# EasyEDA Pro project ESP8266开发板.eprj

# Schematic 原理图
Create Date: 2023-08-28; Page Name: P1; Project Name: ESP8266开发板; Schematic Name: 原理图; Update Date: 2023-08-28
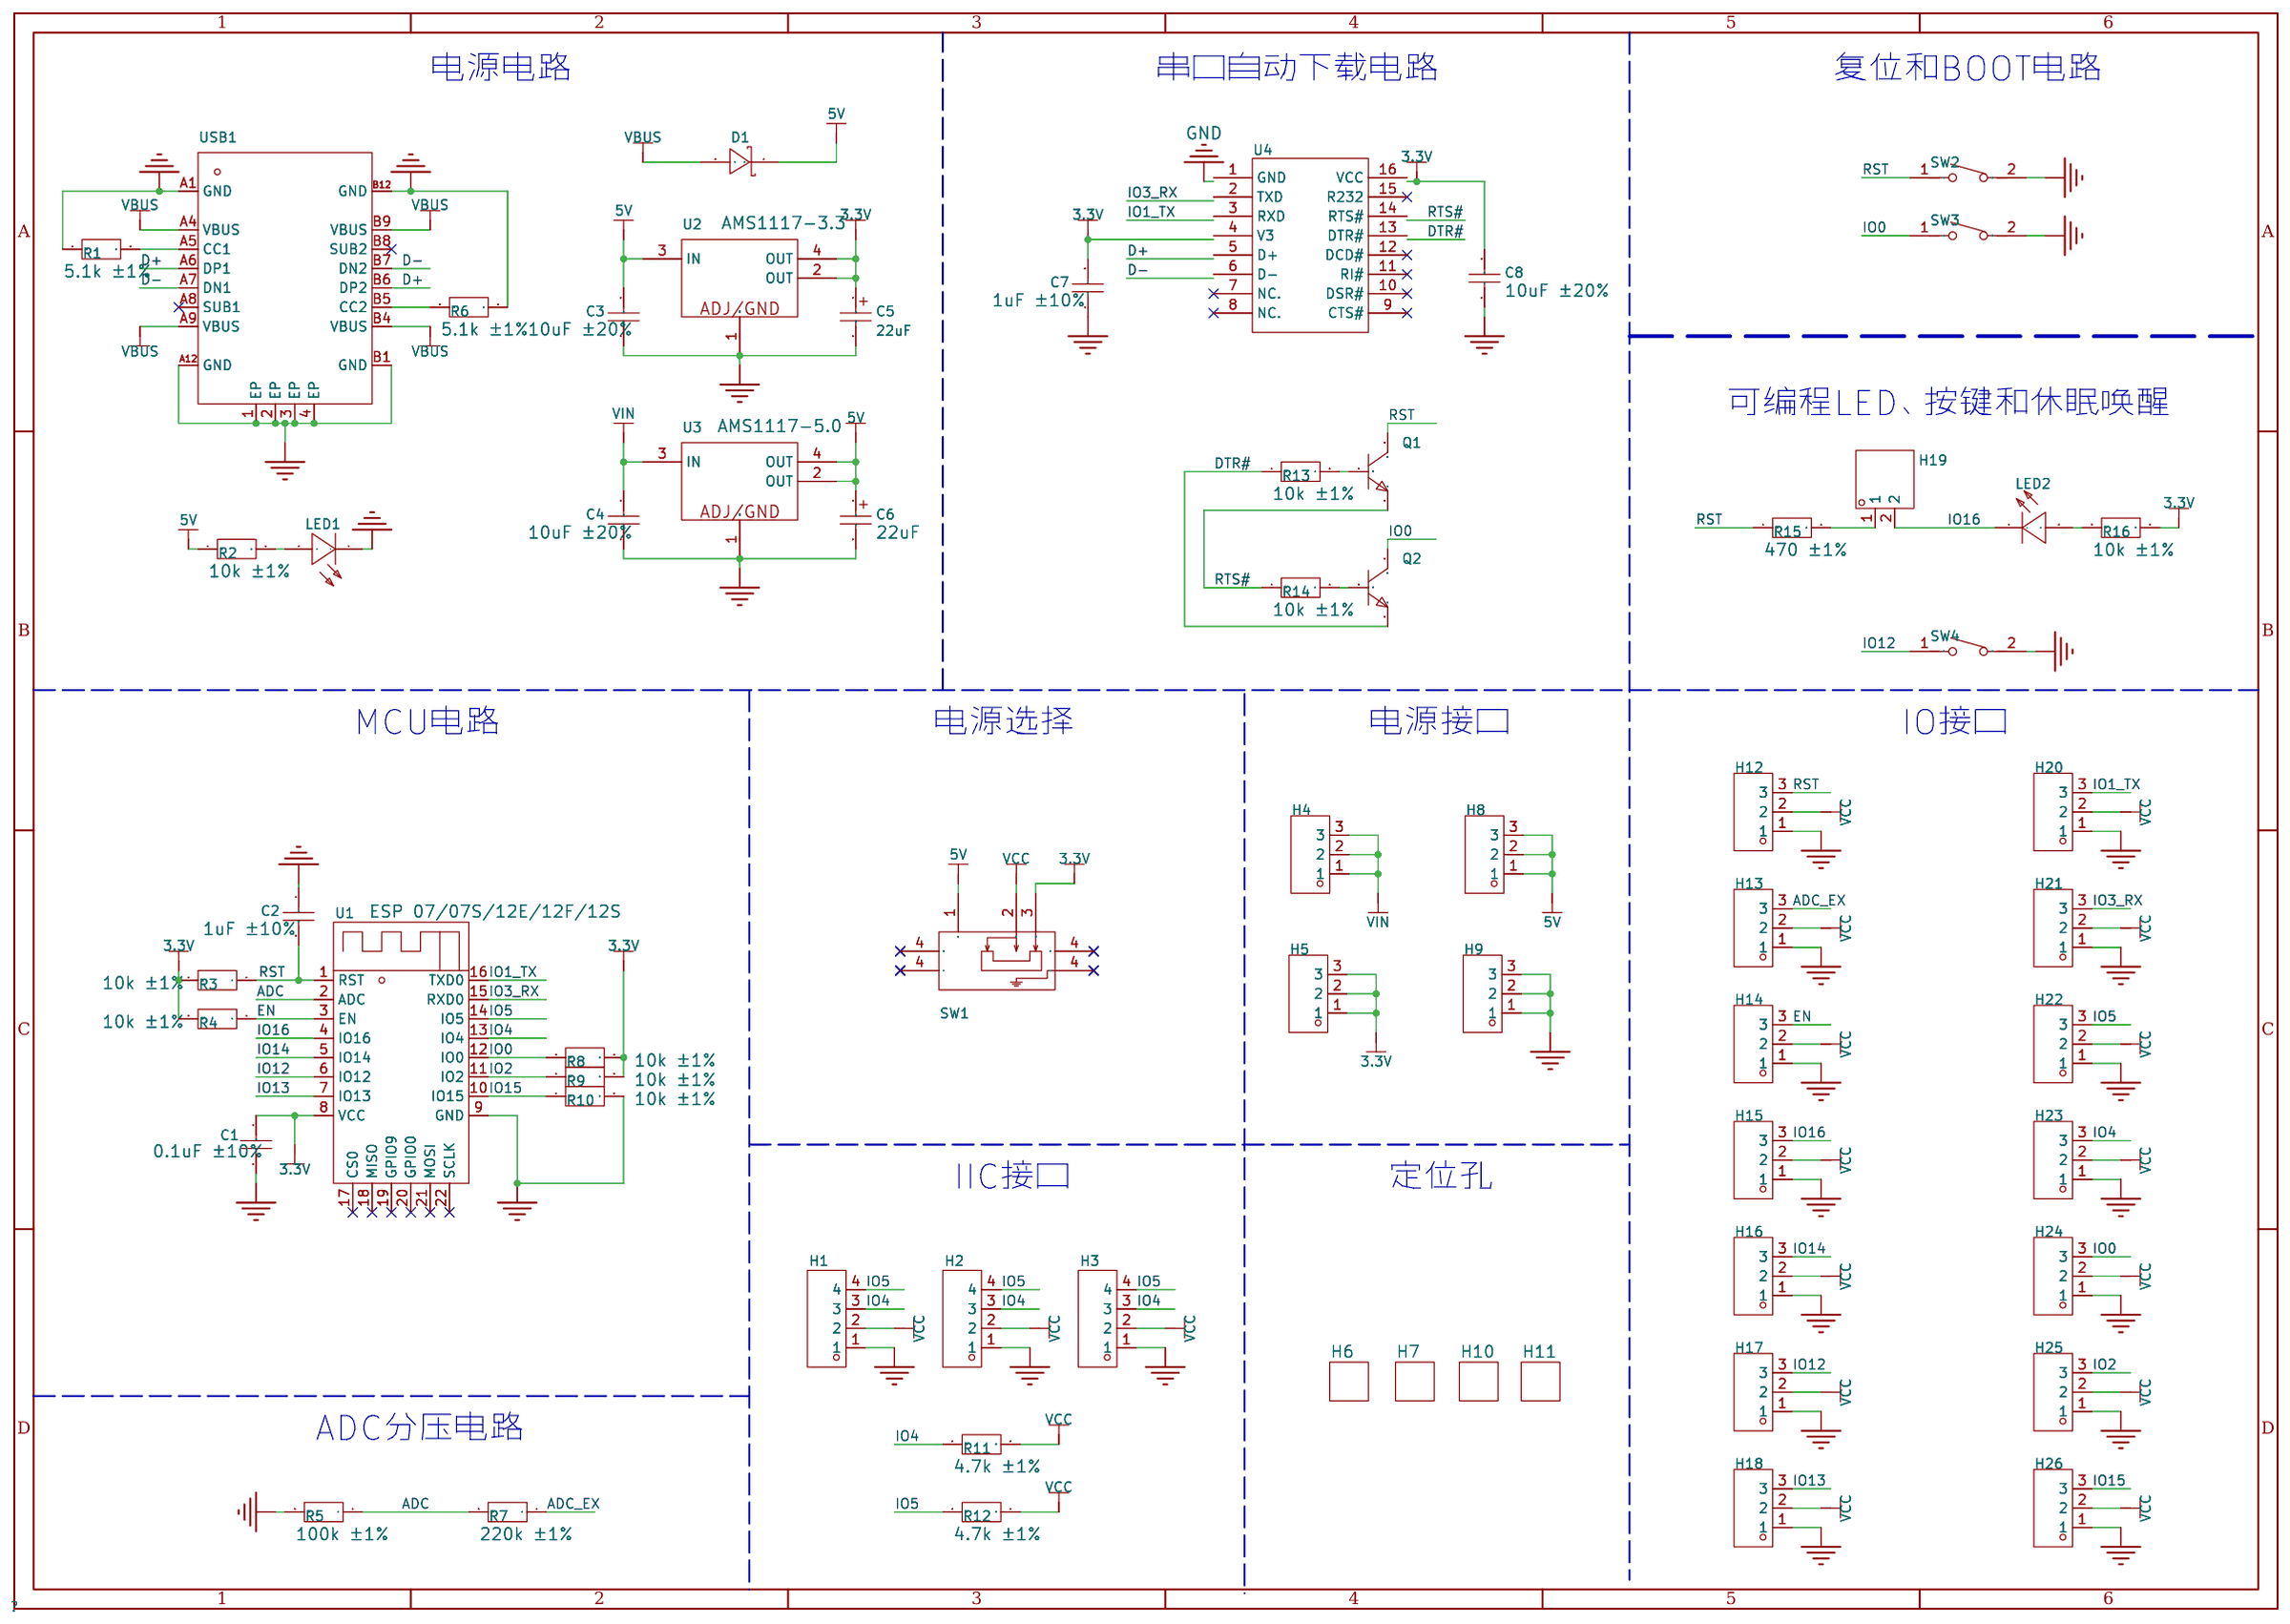
[diagram p0: schematic sheet]

## Parts
C1  0.1uF ±10%  [C0603]
C2  1uF ±10%  [C0603]
C3  10uF ±20%  [C0603]
C4  10uF ±20%  [C0603]
C5  22uF  [CAP-SMD_L3.5-W2.8-R-RD]
C6  22uF  [CAP-SMD_L3.5-W2.8-R-RD]
C7  1uF ±10%  [C0603]
C8  10uF ±20%  [C0603]
D1  SS24  [DO-214AC_L4.3-W2.7-LS5.3-RD]
H1  826629-4  [HDR-TH_4P-P2.54-V-M-1]
H2  826629-4  [HDR-TH_4P-P2.54-V-M-1]
H3  826629-4  [HDR-TH_4P-P2.54-V-M-1]
H4  2.54-1*3P针  [HDR-TH_3P-P2.54-V-M-1]
H5  2.54-1*3P针  [HDR-TH_3P-P2.54-V-M-1]
H6  Hole-3mm-JK 孔  [HOLE-3MM]
H7  Hole-3mm-JK 孔  [HOLE-3MM]
H8  2.54-1*3P针  [HDR-TH_3P-P2.54-V-M-1]
H9  2.54-1*3P针  [HDR-TH_3P-P2.54-V-M-1]
H10  Hole-3mm-JK 孔  [HOLE-3MM]
H11  Hole-3mm-JK 孔  [HOLE-3MM]
H12  2.54-1*3P针  [HDR-TH_3P-P2.54-V-M-1]
H13  2.54-1*3P针  [HDR-TH_3P-P2.54-V-M-1]
H14  2.54-1*3P针  [HDR-TH_3P-P2.54-V-M-1]
H15  2.54-1*3P针  [HDR-TH_3P-P2.54-V-M-1]
H16  2.54-1*3P针  [HDR-TH_3P-P2.54-V-M-1]
H17  2.54-1*3P针  [HDR-TH_3P-P2.54-V-M-1]
H18  2.54-1*3P针  [HDR-TH_3P-P2.54-V-M-1]
H19  -  [HDR-TH_2P-P2.54-V-M-1]
H20  2.54-1*3P针  [HDR-TH_3P-P2.54-V-M-1]
H21  2.54-1*3P针  [HDR-TH_3P-P2.54-V-M-1]
H22  2.54-1*3P针  [HDR-TH_3P-P2.54-V-M-1]
H23  2.54-1*3P针  [HDR-TH_3P-P2.54-V-M-1]
H24  2.54-1*3P针  [HDR-TH_3P-P2.54-V-M-1]
H25  2.54-1*3P针  [HDR-TH_3P-P2.54-V-M-1]
H26  2.54-1*3P针  [HDR-TH_3P-P2.54-V-M-1]
LED1  -  [LED0805-RD]
LED2  -  [LED0805-RD]
Q1  S8050  [SOT-23-3_L2.9-W1.3-P1.90-LS2.4-BR]
Q2  S8050  [SOT-23-3_L2.9-W1.3-P1.90-LS2.4-BR]
R1  5.1k ±1%  [R0603]
R2  10k ±1%  [R0603]
R3  10k ±1%  [R0603]
R4  10k ±1%  [R0603]
R5  100k ±1%  [R0603]
R6  5.1k ±1%  [R0603]
R7  220k ±1%  [R0603]
R8  10k ±1%  [R0603]
R9  10k ±1%  [R0603]
R10  10k ±1%  [R0603]
R11  4.7k ±1%  [R0603]
R12  4.7k ±1%  [R0603]
R13  10k ±1%  [R0603]
R14  10k ±1%  [R0603]
R15  470 ±1%  [R0603]
R16  10k ±1%  [R0603]
SW1  MSK12C02  [SW-TH_MSK12C02]
SW2  TS-KG88C-ACT25F  [KEY-SMD_L4.0-W2.9-LS4.8]
SW3  TS-KG88C-ACT25F  [KEY-SMD_L4.0-W2.9-LS4.8]
SW4  TS-KG88C-ACT25F  [KEY-SMD_L4.0-W2.9-LS4.8]
U1  ESP 07/07S/12E/12F/12S  [WIFIM-SMD_22P-L24.0-W16.0-P2.00]
U2  AMS1117-3.3  [SOT-223-3_L6.4-W3.5-P2.30-LS7.0-BR]
U3  AMS1117-5.0  [SOT-223-3_L6.4-W3.5-P2.30-LS7.0-BR]
U4  CH340C  [SOP-16_L10.0-W3.9-P1.27-LS6.0-BL]
USB1  KH-TYPE-C-16P  [USB-C-SMD_KH-TYPE-C-16P]

## Library data of the parts
C1 = C0603: 1uF ±10%; Pin Type: IN
C2 C7 C8 = C0603: Pin Type: IN
C3 C4 = C0603: 10uF ±10%; Pin Type: IN
C5 C6 = CA45-B-25V-22uF: LCSC Part Name: 22uF(106) ±10% 25V; Supplier Part: C128259; Manufacturer: CEC(振华新云); Manufacturer Part: CA45-B-25V-22uF-K; Supplier Footprint: CASE-B_3528; Datasheet: https://atta.szlcsc.com/upload/public/pdf/source/20170914/C128259_1505359753672967907.pdf; Supplier: LCSC; Operating Temperature: -55~+125; Equivalent Series Resistance(ESR): 6Ω 100kHz; Rated Voltage: 25V; Tolerance: ±10%
D1 = SS24: 直流反向耐压(Vr):40V;平均整流电流(Io):2A;正向压降(Vf):500mV@2A;; LCSC Part Name: 40V 2A 500mV@2A; Supplier Part: C84028; Manufacturer: 星海; Supplier Footprint: SMA(DO-214AC); JLCPCB Part Class: Extended Part; Datasheet: https://atta.szlcsc.com/upload/public/pdf/source/20170717/C84028_1500269981899820784.pdf; Supplier: LCSC; Reverse Voltage (Vr): 40V; Average Rectified Current (Io): 2A; Forward Voltage (Vf@If): 500mV@2A
H1-H3 = 826629-4: 间距:2.54mm;总PIN位数:4;排数:1;插针结构:1x4P;行距:-;安装类型:直插;圆针/方针:-;额定电流:-;额定电压:-;配合针长度:6.7mm;塑高:2.8mm;端接针长度:3.2mm;触头材质:-;工作温度范围:-;颜色:绿色;; LCSC Part Name: 2.54mm 1x4P 直插; Supplier Part: C590277; Manufacturer: TE Connectivity(美国泰科); Supplier Footprint: 直插,P=2.54mm; JLCPCB Part Class: Extended Part; Datasheet: https://atta.szlcsc.com/upload/public/pdf/source/20210923/FCC8CD9A04BA2624CF68C067B4A5B53A.pdf; Supplier: LCSC; Pitch: 2.54mm; Number of Pins: 4; Number of Rows: 1; Pin Structure: 1x4P; Mounting Type: 直插; Length of Mating Pin: 6.7mm; Insulation Height: 2.8mm; Length of End Connection Pin: 3.2mm; Color: 绿色
H4 H5 H8 H9 H12-H18 H20-H26 = 2.54-1*3P针: 间距:2.54mm;总PIN位数:3;排数:1;插针结构:1x3P;行距:-;安装类型:直插;圆针/方针:方针;额定电流:3A;额定电压:-;配合针长度:-;塑高:-;端接针长度:-;触头材质:-;触头镀层:-;工作温度范围:-40℃~+105℃;颜色:黑色;; LCSC Part Name: 2.54mm 1x3P 直插 方针; Supplier Part: C49257; Manufacturer: BOOMELE(博穆精密); Supplier Footprint: 插件,P=2.54mm; JLCPCB Part Class: Extended Part; Datasheet: https://atta.szlcsc.com/upload/public/pdf/source/20151109/1457707570948.pdf; Supplier: LCSC; Pitch: 2.54mm; Number of Pins: 3; Number of Rows: 1; Pin Structure: 1x3P; Mounting Type: 直插; Circluar Pins/Square Pins: 方针; Current Rating (Max): 3A; Operating Temperature Range: -40℃~+105℃; Color: 黑色
H6 H7 H10 H11 = Hole-3mm-JK 孔: Manufacturer Part: Hole-3mm
H19 = HDR-M_2.54_1x2P: Supplier Part: C124375; Supplier Footprint: 插件
LED1 LED2 = LED 0805: LED 0805;; Manufacturer: 国星光电; Supplier Footprint: 0805
Q1 Q2 = S8050: NPN 25V 500mA 120-400 SOT-23; Supplier Part: C2931719; Manufacturer: Doeshare(德芯); Supplier Footprint: SOT-23; JLCPCB Part Class: Extended Part; Datasheet: https://atta.szlcsc.com/upload/public/pdf/source/20220117/E6D3315E0D6ADDB25840BFFAC039C5C0.pdf; Supplier: LCSC
R1 R5-R7 R11 R12 R15 = CR0603FA4R30G: 10k ±1%; LCSC Part Name: 10k ±1%; Supplier Part: C3037517; Manufacturer: LIZ(丽智电子); Supplier Footprint: 0603; Datasheet: https://atta.szlcsc.com/upload/public/pdf/source/20180403/C189438_6D658388CC7843F35BBC9018D03F0B8E.pdf; Supplier: LCSC
R2-R4 R8-R10 R13 R14 R16 = CR0603FA4R30G: Supplier Part: C3037517; Manufacturer: LIZ(丽智电子); Supplier Footprint: 0603; Datasheet: https://atta.szlcsc.com/upload/public/pdf/source/20180403/C189438_6D658388CC7843F35BBC9018D03F0B8E.pdf; Supplier: LCSC
SW1 = MSK12C02: LCSC Part Name: 两档侧拨贴片 7脚 拨动 白柄 柄长1.5mm,带定位柱; Supplier Part: C431540; Manufacturer: SHOU HAN(首韩); Supplier Footprint: SMD; JLCPCB Part Class: 扩展库; Datasheet: https://atta.szlcsc.com/upload/public/pdf/source/20190925/C431540_89155AEF0758B9AD1B2D805F83FB12E3.pdf; Supplier: LCSC
SW2-SW4 = TS-KG88C-ACT25F: 触点电流:50mA;额定电压(DC):12V;绝缘电阻:100MΩ;电路结构:单刀单掷;安装方式:立贴;按钮形状:圆形按钮;按钮/盖帽颜色:黑色;作用力:250gf@±50gf;引脚样式:SMD接片;开关长度:4mm;开关宽度:2.9mm;开关高度:2.5mm;带支架:否;; LCSC Part Name: 3*4*2.5两脚贴片正按小龟轻触开关; Supplier Part: C2874431; Manufacturer: HANBO(汉博); Supplier Footprint: SMD; JLCPCB Part Class: Extended Part; Datasheet: https://atta.szlcsc.com/upload/public/pdf/source/20210827/A314F28E685D7845759E07CCF7D4F190.pdf; Supplier: LCSC; Contact Current: 50mA; Voltage Rating (DC): 12V; Insulation Resistance: 100MΩ; Circuit: 单刀单掷; Mounting Style: 立贴; Actuator Style: 圆形按钮; Actuator/Cap Color: 黑色; Operating Force: 250gf@±50gf; Pin Style: SMD接片; Switch Length: 4mm; Switch Width: 2.9mm; Switch Height: 2.5mm; Strike Gundam: 否
U1 = WT8266-S5 ESP-12F: WT8266-S5是ESP8266核载PCB天线wifi模组，32位型MCU超低功耗高性价比的嵌入式无线网络控制模块，主频支持80MHz和160MHz,支持RTOS,集成wi-Fi MAC/BB/RF/PA/LNA,外接弹簧天线，支持标准IEEE802.11b/g/n协议，完整的TCP/IP协议栈，可满足智能电网，楼宇自动化，安防，智能家居，远程医疗等物联网应用需求。; Supplier Part: C477829; Manufacturer: Wireless-tag(启明云端); JLCPCB Part Class: 扩展库; Datasheet: https://atta.szlcsc.com/upload/public/pdf/source/20200102/C477829_C0273E46BF0DD2E76CD6AB775D1C166F.pdf; Supplier: LCSC
U2 U3 = AMS1117-3.3: Supplier Part: C2992570; Manufacturer: 国芯佳品; Supplier Footprint: SOT-223; JLCPCB Part Class: Extended Part; Datasheet: https://atta.szlcsc.com/upload/public/pdf/source/20220729/0D21C21EC310E4778671BF6BAE438640.pdf; Supplier: LCSC
U4 = CH340C: 类型:Transceiver;协议类别:USB 2.0;驱动器/接收器数:-;数据速率:2Mbps;; Supplier Part: C84681; Manufacturer: WCH(南京沁恒); Supplier Footprint: SOP-16_150mil; JLCPCB Part Class: Extended Part; Datasheet: https://atta.szlcsc.com/upload/public/pdf/source/20200819/C84681_ADBED554CE321879DBD6B1D06488689C.pdf; Supplier: LCSC; Type: Transceiver; Protocol: USB 2.0; Data Rate: 2Mbps; Supply Voltage: 3.3V, 5V
USB1 = KH-TYPE-C-16P: 连接器类型:Type-C;标准:-;公母:母座;触点数量:16;端口数量:1;安装方式:卧贴;额定电流 - 电源:3A;工作温度范围:-40~+85;; LCSC Part Name: Type-C 母座 卧贴; Supplier Part: C709357; Manufacturer: kinghelm(金航标); Supplier Footprint: SMD; JLCPCB Part Class: Extended Part; Datasheet: https://atta.szlcsc.com/upload/public/pdf/source/20200911/C709357_AA8DCEB38BB20E3035A7ED7AE7667837.pdf; Supplier: LCSC; Connector Type: Type-C; Gender: 母座; Number of Contacts: 16; Number of Ports: 1; Mounting Style: 卧贴; Current Rating - Power (Max): 3A; Operating Temperature Range: -40~+85

## Nets
3.3V: C1.1 C5.1 C7.2 C8.1 H5.1 H5.2 H5.3 R3.2 R4.2 R8.2 R9.2 R16.2 SW1.3 U1.8(VCC) U2.2(OUT) U2.4(OUT)
5V: C3.2 C6.1 D1.1(K) H8.1 H8.2 H8.3 R2.1 SW1.1 U2.3(IN) U3.2(OUT) U3.4(OUT)
GND: C1.2 C2.1 C3.1 C4.1 C5.2 C6.2 C7.1 C8.2 H1.1 H2.1 H3.1 H9.1 H9.2 H9.3 H12.1 H13.1 H14.1 H15.1 H16.1 H17.1 H18.1 H20.1 H21.1 H22.1 H23.1 H24.1 H25.1 H26.1 LED1.1(-) R1.1 R5.2 R6.2 R10.2 SW2.2 SW3.2 SW4.2 U1.9(GND) U2.1(ADJ/GND) U3.1(ADJ/GND) USB1.1(EP) USB1.2(EP) USB1.3(EP) USB1.4(EP) USB1.A1(GND) USB1.A12(GND) USB1.B1(GND) USB1.B12(GND)
VBUS: D1.2(A) USB1.A4(VBUS) USB1.A9(VBUS) USB1.B4(VBUS) USB1.B9(VBUS)
VCC: H1.2 H2.2 H3.2 H12.2 H13.2 H14.2 H15.2 H16.2 H17.2 H18.2 H20.2 H21.2 H22.2 H23.2 H24.2 H25.2 H26.2 R11.1 R12.1 SW1.2
VIN: C4.2 H4.1 H4.2 H4.3 U3.3(IN)
ADC: R5.1 R7.2 U1.2(ADC)
ADC_EX: H13.3 R7.1
D+: USB1.A6(DP1) USB1.B6(DP2)
D-: USB1.A7(DN1) USB1.B7(DN2)
DTR#: Q2.2(E) R13.1
EN: H14.3 R4.1 U1.3(EN)
IO0: H24.3 Q2.3(C) R8.1 SW3.1 U1.12(IO0)
IO1_TX: H20.3 U1.16(TXD0)
IO2: H25.3 R9.1 U1.11(IO2)
IO3_RX: H21.3 U1.15(RXD0)
IO4: H1.3 H2.3 H3.3 H23.3 R11.2 U1.13(IO4)
IO5: H1.4 H2.4 H3.4 H22.3 R12.2 U1.14(IO5)
IO12: H17.3 SW4.1 U1.6(IO12)
IO13: H18.3 U1.7(IO13)
IO14: H16.3 U1.5(IO14)
IO15: H26.3 R10.1 U1.10(IO15)
IO16: H15.3 H19.2 LED2.1(-) U1.4(IO16)
RST: C2.2 H12.3 Q1.3(C) R3.1 R15.1 SW2.1 U1.1(RST)
RTS#: Q1.2(E) R14.1
$1N5501: Q1.1(B) R13.2
$1N5507: R1.2 USB1.A5(CC1)
$1N5511: R6.1 USB1.B5(CC2)
$1N5519: LED1.2(+) R2.2
$1N5528: Q2.1(B) R14.2
$1N19675: LED2.2(+) R16.1
$1N33225: H19.1 R15.2

Not connected (* = marked no-connect by the designer): SW1 4*; U1 17(CS0)* 18(MISO)* 19(GPIO9)* 20(GPIO0)* 21(MOSI)* 22(SCLK)*; U4 1(GND) 2(TXD) 3(RXD) 4(V3) 5(D+) 6(D-) 7(NC.)* 8(NC.)* 9(CTS#)* 10(DSR#)* 11(RI#)* 12(DCD#)* 13(DTR#) 14(RTS#) 15(R232)* 16(VCC); USB1 A8(SUB1)* B8(SUB2)*

## Notes on the sheet
- 电源电路
- 串口自动下载电路
- 复位和BOOT电路
- 可编程LED、按键和休眠唤醒
- MCU电路
- 电源选择
- 电源接口
- IO接口
- IIC接口
- 定位孔
- ADC分压电路

# Board PCB图
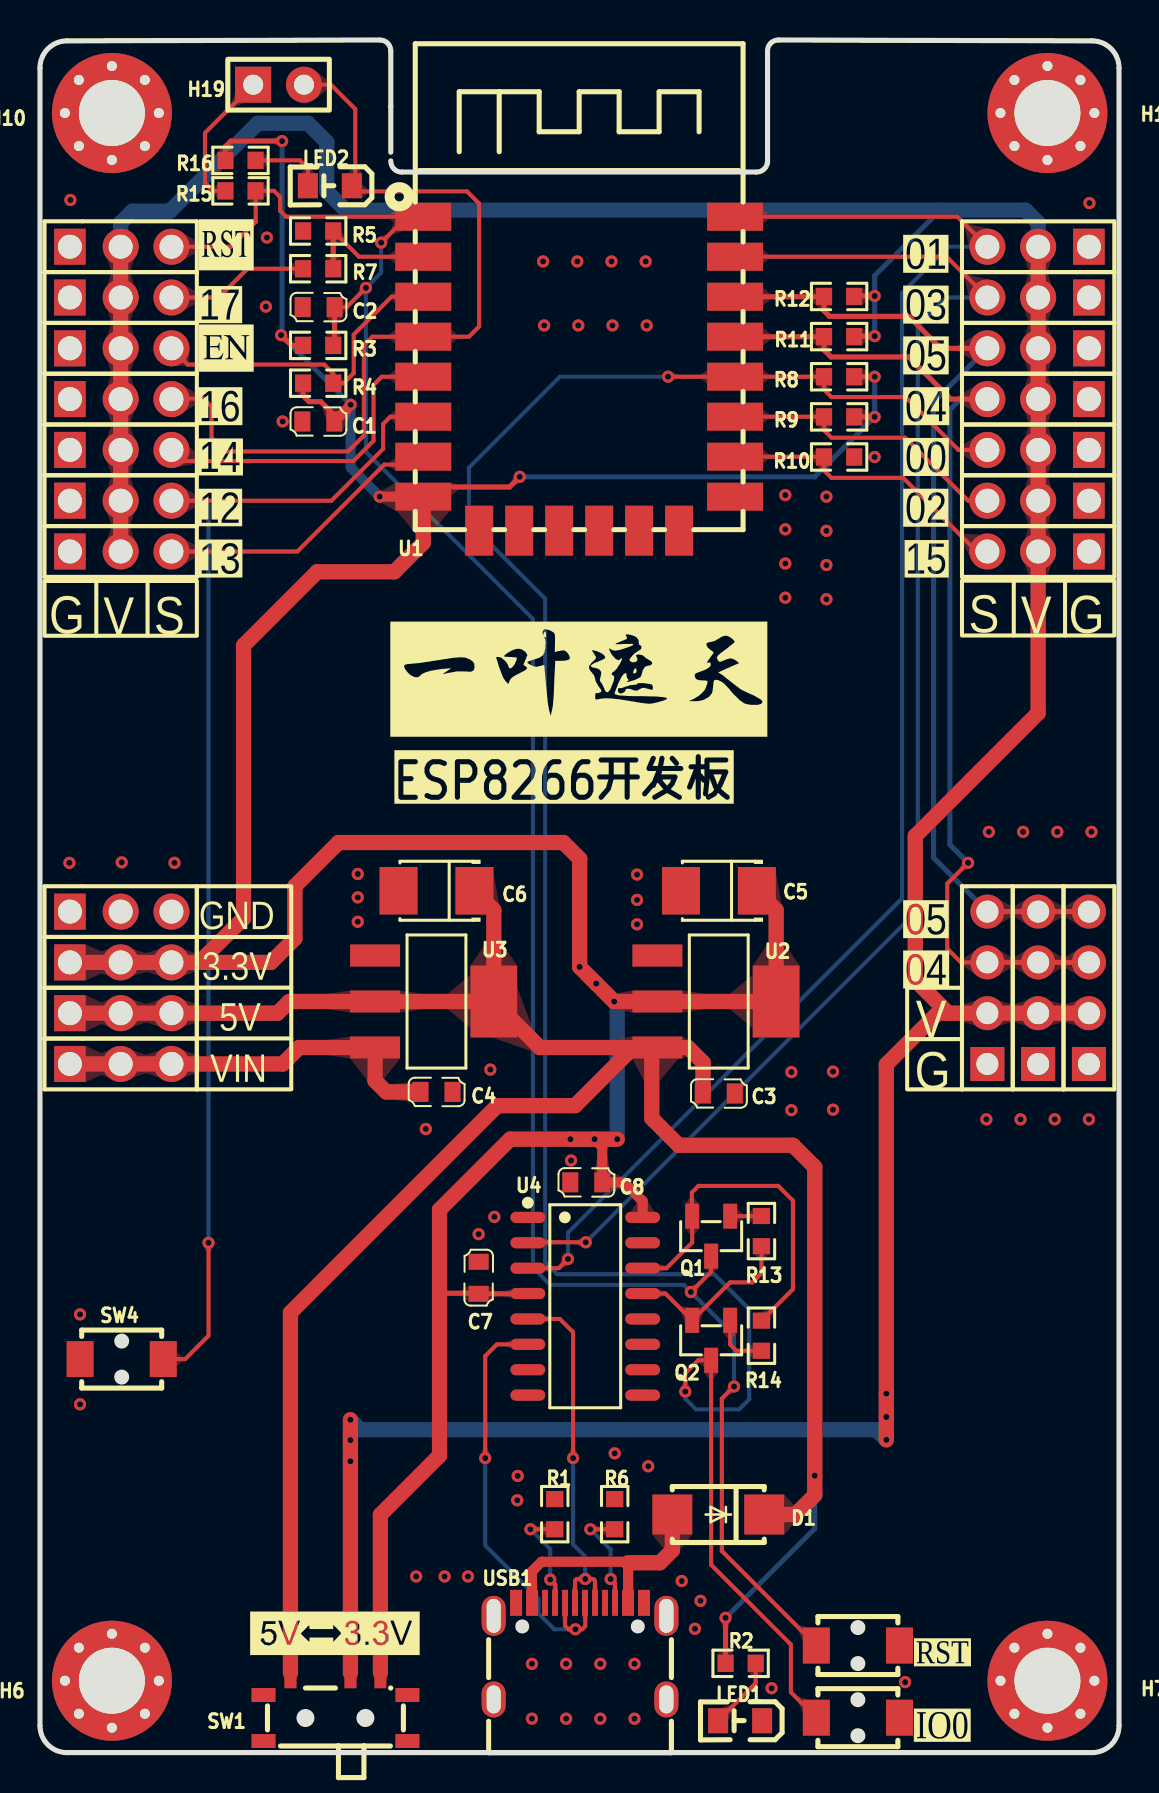
[diagram p1: board, top side]
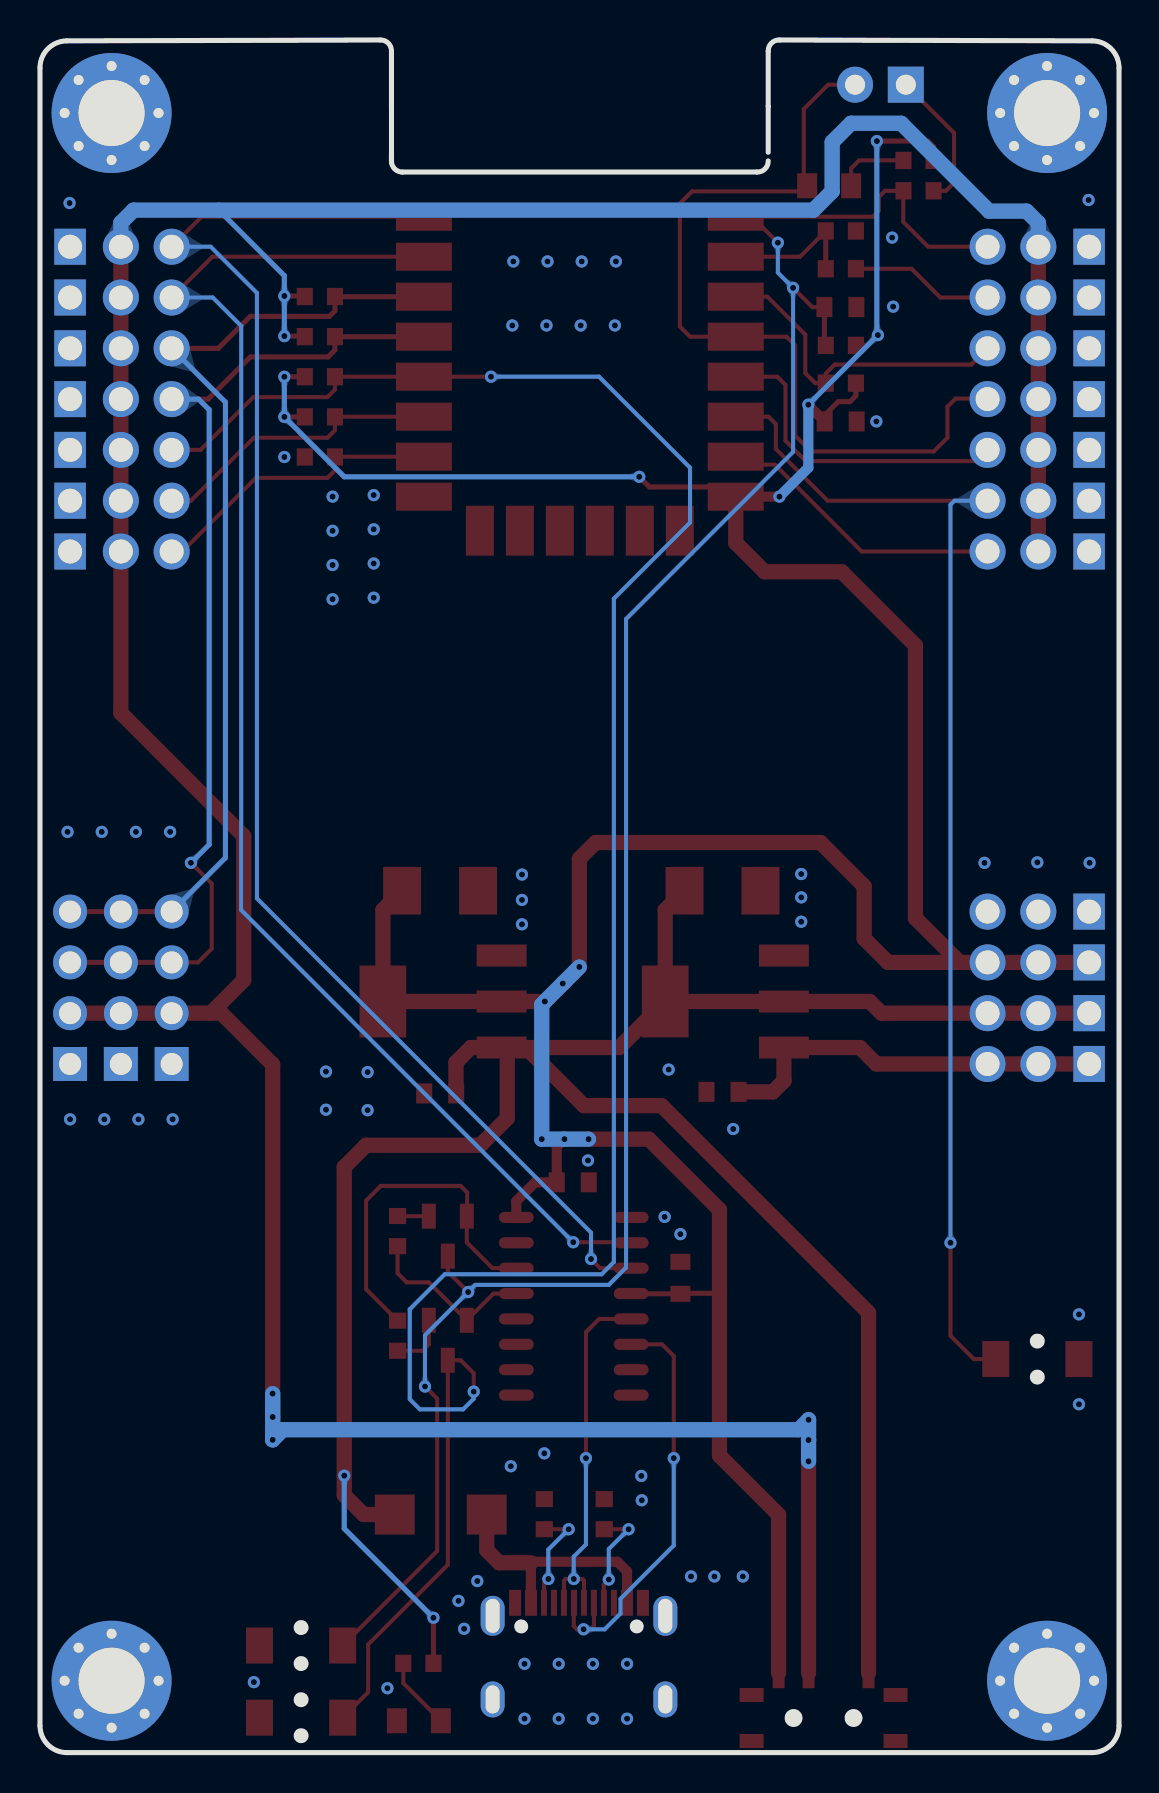
[diagram p2: board, bottom side, seen from below]

Outline 53.98 x 85.64 mm; copper layers: Top Layer, Bottom Layer. Coordinates in mm from the lower left corner of the outline.
Outline path: 17.55,80.03 17.55,85.09 arc(17.39,85.49) 16.99,85.64 1.35,85.6 arc(0.4,85.2) 0,84.25 0,1.35 arc(0.4,0.4) 1.35,0 52.63,0 arc(53.58,0.4) 53.98,1.35 53.98,84.25 arc(53.58,85.2) 52.63,85.6 36.95,85.64 arc(36.55,85.49) 36.4,85.09 36.4,79.5 ; 17.55,79.6 arc(17.71,79.2) 18.11,79.04 35.84,79.04 arc(36.24,79.2) 36.4,79.6 36.4,79.96
Stack: Top Layer 0.035mm / Dielectric1 1.51mm FR4 er 4.5 / Bottom Layer 0.035mm

## Design rules (mm)
spacing safeClearance (default): track to track 0.152, other pairs 0.152 to 0.3
track width trackWidth (default): min 0.152, default 0.203, max 2.54
track width POWER: min 0.254, default 0.762, max 2.54
differential pair differentialPair (default): width min 0.127, default 0.254, max 2.54; gap min 0.152, default 0.152
via viaSize (default): diameter min 0.5, default 0.61, max 10; hole min 0.3, default 0.305, max 6
net GND uses POWER
net 3.3V uses POWER
net VBUS uses POWER
net 5V uses POWER
net VIN uses POWER
net VCC uses POWER

## Placement (name value [footprint] x y rotation side)
C1  0.1uF ±10%  [C0603]  13.92 66.57 180 top
C2  1uF ±10%  [C0603]  13.94 72.29 0 top
C3  10uF ±20%  [C0603]  33.96 32.96 180 top
C4  10uF ±20%  [C0603]  19.84 33.04 180 top
C5  22uF  [CAP-SMD_L3.5-W2.8-R-RD]  33.96 43.1 0 top
C6  22uF  [CAP-SMD_L3.5-W2.8-R-RD]  19.84 43.1 0 top
C7  1uF ±10%  [C0603]  21.94 23.74 270 top
C8  10uF ±20%  [C0603]  27.33 28.52 180 top
D1  SS24  [DO-214AC_L4.3-W2.7-LS5.3-RD]  33.93 11.91 180 top
H1  826629-4  [HDR-TH_4P-P2.54-V-M-1]  47.39 38.25 90 top
H2  826629-4  [HDR-TH_4P-P2.54-V-M-1]  49.93 38.25 90 top
H3  826629-4  [HDR-TH_4P-P2.54-V-M-1]  52.47 38.25 90 top
H4  2.54-1*3P针  [HDR-TH_3P-P2.54-V-M-1]  4.04 34.44 0 top
H5  2.54-1*3P针  [HDR-TH_3P-P2.54-V-M-1]  4.04 39.52 0 top
H6  Hole-3mm-JK 孔  [HOLE-3MM]  3.6 3.59 0 top
H7  Hole-3mm-JK 孔  [HOLE-3MM]  50.4 3.59 0 top
H8  2.54-1*3P针  [HDR-TH_3P-P2.54-V-M-1]  4.04 36.98 0 top
H9  2.54-1*3P针  [HDR-TH_3P-P2.54-V-M-1]  4.04 42.06 0 top
H10  Hole-3mm-JK 孔  [HOLE-3MM]  3.6 81.99 0 top
H11  Hole-3mm-JK 孔  [HOLE-3MM]  50.4 81.99 0 top
H12  2.54-1*3P针  [HDR-TH_3P-P2.54-V-M-1]  4.04 75.31 0 top
H13  2.54-1*3P针  [HDR-TH_3P-P2.54-V-M-1]  4.04 72.77 0 top
H14  2.54-1*3P针  [HDR-TH_3P-P2.54-V-M-1]  4.04 70.23 0 top
H15  2.54-1*3P针  [HDR-TH_3P-P2.54-V-M-1]  4.04 67.69 0 top
H16  2.54-1*3P针  [HDR-TH_3P-P2.54-V-M-1]  4.04 65.15 0 top
H17  2.54-1*3P针  [HDR-TH_3P-P2.54-V-M-1]  4.04 62.61 0 top
H18  2.54-1*3P针  [HDR-TH_3P-P2.54-V-M-1]  4.04 60.07 0 top
H19  -  [HDR-TH_2P-P2.54-V-M-1]  11.94 83.41 0 top
H20  2.54-1*3P针  [HDR-TH_3P-P2.54-V-M-1]  49.93 75.31 180 top
H21  2.54-1*3P针  [HDR-TH_3P-P2.54-V-M-1]  49.93 72.77 180 top
H22  2.54-1*3P针  [HDR-TH_3P-P2.54-V-M-1]  49.93 70.23 180 top
H23  2.54-1*3P针  [HDR-TH_3P-P2.54-V-M-1]  49.93 67.69 180 top
H24  2.54-1*3P针  [HDR-TH_3P-P2.54-V-M-1]  49.93 65.15 180 top
H25  2.54-1*3P针  [HDR-TH_3P-P2.54-V-M-1]  49.93 62.61 180 top
H26  2.54-1*3P针  [HDR-TH_3P-P2.54-V-M-1]  49.93 60.07 180 top
LED1  -  [LED0805-RD]  35.02 1.59 180 top
LED2  -  [LED0805-RD]  14.5 78.35 180 top
Q1  S8050  [SOT-23-3_L2.9-W1.3-P1.90-LS2.4-BR]  33.58 25.83 90 top
Q2  S8050  [SOT-23-3_L2.9-W1.3-P1.90-LS2.4-BR]  33.58 20.62 90 top
R1  5.1k ±1%  [R0603]  25.75 11.92 270 top
R2  10k ±1%  [R0603]  35.05 4.47 0 top
R3  10k ±1%  [R0603]  13.92 70.37 180 top
R4  10k ±1%  [R0603]  13.92 68.48 180 top
R5  100k ±1%  [R0603]  13.92 76.09 180 top
R6  5.1k ±1%  [R0603]  28.75 11.92 90 top
R7  220k ±1%  [R0603]  13.92 74.2 0 top
R8  10k ±1%  [R0603]  39.98 68.8 0 top
R9  10k ±1%  [R0603]  39.98 66.8 0 top
R10  10k ±1%  [R0603]  39.98 64.79 0 top
R11  4.7k ±1%  [R0603]  39.98 70.81 180 top
R12  4.7k ±1%  [R0603]  39.98 72.82 180 top
R13  10k ±1%  [R0603]  36.09 26.08 90 top
R14  10k ±1%  [R0603]  36.09 20.85 270 top
R15  470 ±1%  [R0603]  10.03 78.1 180 top
R16  10k ±1%  [R0603]  10.03 79.62 180 top
SW1  MSK12C02  [SW-TH_MSK12C02]  14.78 2.28 0 top
SW2  TS-KG88C-ACT25F  [KEY-SMD_L4.0-W2.9-LS4.8]  40.92 5.35 0 top
SW3  TS-KG88C-ACT25F  [KEY-SMD_L4.0-W2.9-LS4.8]  40.92 1.75 0 top
SW4  TS-KG88C-ACT25F  [KEY-SMD_L4.0-W2.9-LS4.8]  4.09 19.68 180 top
U1  ESP 07/07S/12E/12F/12S  [WIFIM-SMD_22P-L24.0-W16.0-P2.00]  26.97 68.96 90 top
U2  AMS1117-3.3  [SOT-223-3_L6.4-W3.5-P2.30-LS7.0-BR]  33.86 37.56 180 top
U3  AMS1117-5.0  [SOT-223-3_L6.4-W3.5-P2.30-LS7.0-BR]  19.73 37.56 180 top
U4  CH340C  [SOP-16_L10.0-W3.9-P1.27-LS6.0-BL]  27.28 22.32 270 top
USB1  KH-TYPE-C-16P  [USB-C-SMD_KH-TYPE-C-16P]  27.02 5.08 0 top

## Footprints (pads in the part's own frame, mm; a bottom-side part is the same pattern mirrored in y, then rotated)
C0603
  rect 0.8x1.001 smd: 1(-0.8,0) 2(0.8,0)
CAP-SMD_L3.5-W2.8-R-RD
  rect 1.9x2.375 smd: 1(1.9,0) 2(-1.897,0)
DO-214AC_L4.3-W2.7-LS5.3-RD
  rect 1.999x1.999 smd: 1(-2.299,0) 2(2.301,0)
HDR-TH_2P-P2.54-V-M-1
  rect 1.8x1.8 hole 1: 1(-1.27,0)
  round 1.8 hole 1: 2(1.27,0)
HDR-TH_3P-P2.54-V-M-1
  rect 1.575x1.801 hole 1.199: 1(-2.54,0)
  round 1.801 hole 1.199: 2(0,0) 3(2.54,0)
HDR-TH_4P-P2.54-V-M-1
  rect 1.7x1.7 hole 1.1: 1(-3.81,0)
  round 1.7 hole 1.1: 2(-1.27,0) 3(1.27,0) 4(3.81,0)
HOLE-3MM
  round 1 hole 0.5: 0(-2.349,0) 0(-1.651,1.651) 0(-1.651,-1.651) 0(0,2.349) 0(0,-2.349) 0(1.651,1.651) 0(1.651,-1.651) 0(2.349,0)
  round 6 hole 3.302: 0(0,0)
KEY-SMD_L4.0-W2.9-LS4.8
  rect 1.35x1.8 smd: 1(-2.08,0) 2(2.08,0)
LED0805-RD
  rect 1.001x1.25 smd: 1(-1.1,0) 2(1.1,0)
R0603
  rect 0.806x0.864 smd: 1(-0.753,0) 2(0.753,0)
SOP-16_L10.0-W3.9-P1.27-LS6.0-BL
  oval 0.56x1.745 smd: 1(-4.445,-2.873) 2(-3.175,-2.873) 3(-1.905,-2.873) 4(-0.635,-2.873) 5(0.635,-2.873) 6(1.905,-2.873) 7(3.175,-2.873) 8(4.445,-2.873) 9(4.445,2.873) 10(3.175,2.873) 11(1.905,2.873) 12(0.635,2.873) 13(-0.635,2.873) 14(-1.905,2.873) 15(-3.175,2.873) 16(-4.445,2.873)
SOT-23-3_L2.9-W1.3-P1.90-LS2.4-BR
  rect 1.25x0.7 smd: 1(1,-0.95) 2(1,0.95) 3(-1,0)
SOT-223-3_L6.4-W3.5-P2.30-LS7.0-BR
  rect 2.499x1.1 smd: 1(2.97,-2.299) 2(2.97,0) 3(2.97,2.301)
  rect 2.34x3.599 smd: 4(-2.97,0)
SW-TH_MSK12C02
  rect 0.6x1.524 smd: 1(-2.25,1.7) 2(0.75,1.7) 3(2.25,1.7)
  rect 1.2x0.7 smd: 4(-3.6,0.6) 4(-3.6,-1.7) 4(3.6,0.6) 4(3.6,-1.7)
USB-C-SMD_KH-TYPE-C-16P
  oval 1.2x2 hole 0.7x1.7: 1(-4.32,1.765) 2(4.32,1.765)
  oval 1.2x1.8 hole 0.7x1.4: 3(-4.32,-2.415) 4(4.32,-2.415)
  rect 0.3x1.3 smd: A1(-3.35,2.415) A4(-2.55,2.415) A5(-1.25,2.415) A6(-0.25,2.415) A7(0.25,2.415) A8(1.25,2.415) A9(2.55,2.415) A12(3.35,2.415) B1(3.05,2.415) B4(2.25,2.415) B5(1.75,2.415) B6(0.75,2.415) B7(-0.75,2.415) B8(-1.75,2.415) B9(-2.25,2.415) B12(-3.05,2.415)
WIFIM-SMD_22P-L24.0-W16.0-P2.00
  rect 1.4x2.8 smd: 1(7.85,7.8) 2(5.85,7.8) 3(3.85,7.8) 4(1.85,7.8) 5(-0.15,7.8) 6(-2.15,7.8) 7(-4.15,7.8) 8(-6.15,7.8) 9(-6.15,-7.8) 10(-4.15,-7.8) 11(-2.15,-7.8) 12(-0.15,-7.8) 13(1.85,-7.8) 14(3.85,-7.8) 15(5.85,-7.8) 16(7.85,-7.8)
  rect 2.5x1.4 smd: 17(-7.85,5) 18(-7.85,3) 19(-7.85,1) 20(-7.85,-1) 21(-7.85,-3) 22(-7.85,-5)

## Nets
3.3V: C1.1 C5.1 C7.2 C8.1 H5.1 H5.2 H5.3 R3.2 R4.2 R8.2 R9.2 R16.2 SW1.3 U1.8 U2.2 U2.4 U4.4 U4.16
5V: C3.2 C6.1 D1.1 H8.1 H8.2 H8.3 R2.1 SW1.1 U2.3 U3.2 U3.4
GND: C1.2 C2.1 C3.1 C4.1 C5.2 C6.2 C7.1 C8.2 H1.1 H2.1 H3.1 H9.1 H9.2 H9.3 H12.1 H13.1 H14.1 H15.1 H16.1 H17.1 H18.1 H20.1 H21.1 H22.1 H23.1 H24.1 H25.1 H26.1 LED1.1 R1.1 R5.2 R6.2 R10.2 SW2.2 SW3.2 SW4.2 U1.9 U2.1 U3.1 U4.1 USB1.1 USB1.2 USB1.3 USB1.4 USB1.A1 USB1.A12 USB1.B1 USB1.B12
VBUS: D1.2 USB1.A4 USB1.A9 USB1.B4 USB1.B9
VCC: H1.2 H2.2 H3.2 H12.2 H13.2 H14.2 H15.2 H16.2 H17.2 H18.2 H20.2 H21.2 H22.2 H23.2 H24.2 H25.2 H26.2 R11.1 R12.1 SW1.2
VIN: C4.2 H4.1 H4.2 H4.3 U3.3
ADC: R5.1 R7.2 U1.2
ADC_EX: H13.3 R7.1
D+: U4.5 USB1.A6 USB1.B6
D-: U4.6 USB1.A7 USB1.B7
DTR#: Q2.2 R13.1 U4.13
EN: H14.3 R4.1 U1.3
IO0: H24.3 Q2.3 R8.1 SW3.1 U1.12
IO1_TX: H20.3 U1.16 U4.3
IO2: H25.3 R9.1 U1.11
IO3_RX: H21.3 U1.15 U4.2
IO4: H1.3 H2.3 H3.3 H23.3 R11.2 U1.13
IO5: H1.4 H2.4 H3.4 H22.3 R12.2 U1.14
IO12: H17.3 SW4.1 U1.6
IO13: H18.3 U1.7
IO14: H16.3 U1.5
IO15: H26.3 R10.1 U1.10
IO16: H15.3 H19.2 LED2.1 U1.4
RST: C2.2 H12.3 Q1.3 R3.1 R15.1 SW2.1 U1.1
RTS#: Q1.2 R14.1 U4.14
$1N5501: Q1.1 R13.2
$1N5507: R1.2 USB1.A5
$1N5511: R6.1 USB1.B5
$1N5519: LED1.2 R2.2
$1N5528: Q2.1 R14.2
$1N19675: LED2.2 R16.1
$1N33225: H19.1 R15.2

Pads without a net: H6 0; H7 0; H10 0; H11 0; SW1 4; U1 17 18 19 20 21 22; U4 7 8 9 10 11 12 15; USB1 A8 B8

## Via types
v1: diameter 0.61, hole 0.305, Top Layer to Bottom Layer, 111 vias

## Routing (per net, layer and track width the routed paths; a pad name or vN(x,y) marks a point on that pad's centre or on a via; arc(x,y) is an arc through that point)
3.3V: length 197.8
  Top Layer w0.254: R4.2 13.16,67.86 13.46,67.56 14.04,67.56 14.72,66.88 C1.1 ; 19.17,62.81 19.66,63.29 23.49,63.29 v1(24,63.8) ; R3.2 12.58,70.37 v1(12.06,70.89) ; 19.99,22.97 21.92,22.97 C7.2 24.39,22.94 U4.4 ; v1(41.76,66.8) R9.2 ; v1(12.11,80.59) 9.55,80.59 9.28,80.32 R16.2 ; v1(41.76,68.8) R8.2
  Top Layer w0.508: C1.1 15.54,67.39 v1(15.54,67.41) ; 16.97,62.81 16.97,62.81 19.17,62.81 ; U4.16 30.15,27.58 29.21,28.52 C8.1 28.13,30.29 v1(27.74,30.68)
  Top Layer w0.762: 7.97,39.52 10.18,41.73 10.18,55.37 13.87,59.05 17.73,59.05 19.17,60.5 19.17,62.81 ; 7.97,39.52 11.55,39.52 12.75,40.71 12.75,43.33 14.93,45.51 26.19,45.51 27,44.7 v1(27,39.29) v1(27.83,38.46) v1(28.73,37.56) U2.2 U2.4 36.83,42.14 C5.1 ; 7.97,39.52 H5.3 H5.2 H5.1 ; v1(28.88,30.68) v1(27.74,30.68) v1(26.54,30.68) 23.52,30.68 19.99,27.15 19.99,14.85 17.03,11.9 SW1.3
  Bottom Layer w0.254: v1(12.11,80.59) 12.11,70.94 v1(12.06,70.89) v1(15.54,67.41) ; v1(24,63.8) 38.76,63.8 v1(41.76,66.8) v1(41.76,68.8)
  Bottom Layer w0.508: v1(16.99,62.81) 15.54,64.26 v1(15.54,67.41)
  Bottom Layer w0.762: v1(26.54,30.68) v1(27.74,30.68) v1(28.88,30.68) 28.88,37.41 v1(28.73,37.56) v1(27.83,38.46) v1(27,39.29)
5V: length 124.7
  Top Layer w0.254: 34.29,6.75 v1(34.3,6.74) R2.1
  Top Layer w0.762: 29.68,35.26 25,35.26 22.7,37.56 ; 29.68,35.26 26.77,32.35 22.88,32.35 12.53,22 SW1.1 ; 29.68,35.26 U2.3 ; D1.1 37.79,11.91 38.76,12.87 v1(38.76,13.85) 38.76,29.28 37.67,30.37 31.95,30.37 30.61,31.72 30.61,34.98 U2.3 ; C6.1 22.7,42.13 22.7,37.56 ; 22.7,37.56 U3.2 12.47,37.56 11.89,36.98 H8.3 H8.2 H8.1 ; U2.3 32.42,35.26 33.17,34.51 33.17,32.98 C3.2
  Bottom Layer w0.254: v1(34.3,6.74) 38.76,11.2 v1(38.76,13.85)
GND:
  vias: v1(1.52,77.64) v1(1.47,44.5) v1(2,21.91) v1(2,17.42) v1(4.09,44.52) v1(6.73,44.5) v1(11.3,72.31) v1(11.35,75.76) v1(12.14,66.57) v1(15.9,43.94) v1(15.9,42.77) v1(15.9,41.55) v1(18.82,8.81) v1(19.3,31.19) v1(20.24,8.81) v1(21.41,8.81) v1(21.94,25.93) v1(22.53,34.16) v1(22.73,26.79) v1(23.9,13.84) v1(23.87,12.62) v1(24.61,4.44) v1(24.61,1.7) v1(25.17,74.57) v1(25.22,71.37) v1(26.32,4.44) v1(26.32,1.7) v1(26.57,29.61) v1(26.88,74.57) v1(26.93,71.37) v1(28.03,4.44) v1(28.03,1.7) v1(28.59,74.57) v1(28.64,71.37) v1(28.75,14.97) v1(29.74,4.44) v1(29.74,1.7) v1(29.87,43.91) v1(29.87,42.64) v1(29.87,41.42) v1(30.3,74.57) v1(30.35,71.37) v1(30.43,14.32) v1(32.1,8.58) v1(32.76,6.19) v1(33.04,7.59) v1(36.6,3.22) v1(37.29,62.89) v1(37.29,61.18) v1(37.29,59.47) v1(37.29,57.75) v1(37.59,34.03) v1(37.59,32.13) v1(39.34,62.81) v1(39.34,61.1) v1(39.34,59.39) v1(39.34,57.68) v1(39.67,34.06) v1(39.67,32.15) v1(41.76,64.79) v1(43.28,3.53) v1(47.34,31.67) v1(47.47,46.05) v1(49.05,31.67) v1(49.18,46.05) v1(50.76,31.67) v1(50.89,46.05) v1(52.5,77.49) v1(52.47,31.67) v1(52.6,46.05)
VBUS: length 12.6
  Top Layer w0.508: 29.42,7.65 29.42,9.49 29.37,9.55 25.09,9.55 24.61,9.06 24.61,7.63
  Top Layer w0.762: 29.42,9.49 31.01,9.49 31.63,10.11 31.63,11.91
VCC: length 194.6
  Top Layer w0.254: v1(41.76,70.84) 40.76,70.84 R11.1 ; R12.1 40.76,72.84 v1(41.76,72.84)
  Top Layer w0.762: H3.2 H2.2 H1.2 45.44,36.98 ; SW1.2 v1(15.53,14.57) v1(15.53,15.63) v1(15.53,16.65) ; H20.2 H21.2 H22.2 H23.2 H24.2 H25.2 H26.2 49.93,51.99 43.79,45.84 43.79,38.63 45.44,36.98 ; 45.44,36.98 44.91,36.98 42.34,34.41 v1(42.34,17.95) v1(42.34,16.78) v1(42.34,15.64) ; H12.2 H13.2 H14.2 H15.2 H16.2 H17.2 H18.2
  Bottom Layer w0.254: 45.03,77.14 41.76,73.86 v1(41.76,72.84) v1(41.76,70.84)
  Bottom Layer w0.762: v1(15.53,14.57) v1(15.53,15.63) v1(15.53,16.65) 16.03,16.15 41.83,16.15 v1(42.34,15.64) v1(42.34,16.78) v1(42.34,17.95) ; H20.2 49.93,76.5 49.3,77.14 15.29,77.14 14.35,78.07 14.35,80.54 13.41,81.48 10.89,81.48 6.5,77.08 4.62,77.08 4.04,76.5 H12.2
VIN: length 19.8
  Top Layer w0.762: C4.2 17.32,33.04 16.76,33.6 16.76,33.6 U3.3 12.96,35.26 12.14,34.44 H4.3 H4.2 H4.1
ADC: length 6.9
  Top Layer w0.203: R5.1 15.96,74.81 19.17,74.81
  Top Layer w0.254: R5.1 R7.2
ADC_EX: length 7.2
  Top Layer w0.203: R7.1 10.38,74.2 8.94,72.77 H13.3
D+: length 18.4
  Top Layer w0.203: U4.5 26.01,21.69 26.67,21.03 v1(26.67,14.73) ; USB1.A6 26.77,8.6 26.85,8.68 v1(27.28,8.68) 27.68,8.68 27.77,8.6 USB1.B6
  Bottom Layer w0.203: v1(27.28,8.68) 27.28,9.8 26.67,10.41 v1(26.67,14.73)
D-: length 22
  Top Layer w0.203: U4.6 22.86,20.42 22.27,19.83 v1(22.27,14.73) ; USB1.B7 26.27,6.34 26.44,6.17 v1(26.79,6.17) 27.13,6.17 27.28,6.32 27.28,7.48 USB1.A7
  Bottom Layer w0.203: v1(26.79,6.17) 25.73,6.17 24.94,6.95 24.94,7.69 22.27,10.36 v1(22.27,14.73)
DTR#: length 8.8
  Top Layer w0.203: U4.13 31.29,22.96 32.63,21.62 34.52,23.52 35.63,23.52 36.09,23.97 R13.1
EN: length 16.5
  Top Layer w0.203: 19.17,72.81 17.59,72.81 15.7,70.91 15.7,68.98 15.2,68.48 R4.1 14.67,68.96 14.22,69.41 7.39,69.41 H14.3
IO0: length 113.2
  Top Layer w0.203: H24.3 45.95,65.15 43.3,67.79 39.6,67.79 39.22,68.16 R8.1 39.22,68.81 v1(31.42,68.81) 31.42,68.8 ; SW3.1 37.56,3.02 37.56,5.41 33.58,9.39 Q2.3 32.93,19.62 32.28,18.97 v1(32.28,18.05)
  Bottom Layer w0.203: v1(32.28,18.05) 32.28,17.7 32.82,17.17 34.97,17.17 35.48,17.67 35.48,22.17 33.73,23.92 25.88,23.92 25.27,24.53 25.27,57.7 21.46,61.51 21.46,64.26 26.01,68.81 v1(31.42,68.81)
IO1_TX: length 75.9
  Top Layer w0.203: 34.77,76.81 45.89,76.81 H20.3 ; U4.3 25.96,24.23 v1(26.41,24.68)
  Bottom Layer w0.203: H20.3 45.44,75.31 43.13,72.99 43.13,42.72 26.41,26 v1(26.41,24.68)
IO2: length 14.8
  Top Layer w0.203: H25.3 46.43,62.61 43.28,65.76 39.6,65.76 39.22,66.13 R9.1 39.22,66.81 34.77,66.81
IO3_RX: length 73.1
  Top Layer w0.203: U4.2 24.43,25.52 v1(27.3,25.52) ; 34.77,74.81 45.35,74.81 H21.3
  Bottom Layer w0.203: H21.3 45.34,72.77 43.91,71.34 43.91,42.13 v1(27.3,25.52)
IO4: length 51.5
  Top Layer w0.203: H1.3 46.07,39.52 45.39,40.2 45.39,43.45 v1(46.43,44.5)
  Top Layer w0.254: H3.3 H2.3 H1.3 ; H23.3 45.57,67.69 43.46,69.79 39.57,69.79 39.22,70.14 R11.2 39.22,70.81 34.77,70.81
  Bottom Layer w0.254: H23.3 46.05,67.69 45.52,67.15 45.52,45.41 v1(46.43,44.5)
IO5: length 49.6
  Top Layer w0.254: H22.3 45.06,70.23 43.46,71.83 39.5,71.83 39.22,72.1 R12.2 39.21,72.81 34.77,72.81 ; H3.4 H2.4 H1.4
  Bottom Layer w0.254: H22.3 44.7,67.53 44.7,44.75 H1.4
IO12: length 61.3
  Top Layer w0.203: SW4.1 7.26,19.68 8.43,20.85 v1(8.43,25.5) ; 19.17,66.81 17.53,66.81 17.17,66.44 17.17,65.2 14.58,62.61 H17.3
  Bottom Layer w0.203: v1(8.43,25.5) 8.43,62.4 8.23,62.61 H17.3
IO13: length 14.6
  Top Layer w0.203: 19.17,64.81 18.78,64.41 17.22,64.41 12.88,60.07 H18.3
IO14: length 16.2
  Top Layer w0.203: 19.17,68.81 17.09,68.81 16.69,68.4 16.69,65.6 15.67,64.59 7.14,64.59 H16.3
IO15: length 15
  Top Layer w0.203: 34.77,64.81 39.21,64.81 R10.1 39.22,64.12 39.6,63.75 43.18,63.75 46.86,60.07 H26.3
IO16: length 42.7
  Top Layer w0.203: H15.3 6.6,67.71 8.18,67.71 8.58,67.31 8.58,65.76 9.27,65.07 15.42,65.07 16.2,65.86 16.2,70.38 16.63,70.81 21.46,70.81 21.97,71.32 21.97,77.47 21.36,78.07 15.77,78.07 15.77,78.52 ; H19.2 14.55,83.41 15.77,82.19 15.77,78.52 ; 15.77,78.52 LED2.1
RST: length 107.8
  Top Layer w0.203: 10.79,78.09 10.8,78.1 11.71,78.1 12.01,77.8 12.01,77.11 12.32,76.81 18.36,76.81 ; 10.79,78.09 R15.1 ; 10.79,78.09 10.79,76.55 9.55,75.31 H12.3 ; 19.17,76.81 18.36,76.81 ; 18.36,76.81 v1(17.07,75.51) ; SW2.1 34.11,10.08 34.11,17.7 v1(34.72,18.31) ; Q1.3 33.58,24.05 v1(32.56,23.03) ; v1(16.3,73.25) 15.34,72.29 C2.2
  Top Layer w0.254: R3.1 14.74,70.44 C2.2
  Bottom Layer w0.203: v1(17.07,75.51) 17.07,74.01 v1(16.3,73.25) 16.3,65.04 24.66,56.69 24.66,24.25 25.52,23.39 32.2,23.39 v1(32.56,23.03) 34.72,20.87 v1(34.72,18.31)
RTS#: length 17.7
  Top Layer w0.203: R14.1 37.67,23.18 37.67,27.61 36.93,28.34 32.94,28.34 32.61,28.01 32.61,26.84 32.63,26.83 32.63,25.51 31.34,24.23 U4.14
$1N5501: length 1.6
  Top Layer w0.203: Q1.1 36.08,26.83 R13.2
$1N5507: length 5.4
  Top Layer w0.203: USB1.A5 25.78,7.5 25.78,8.4 v1(25.52,8.66) ; R1.2 v1(24.53,11.17)
  Bottom Layer w0.203: v1(24.53,11.17) 25.52,10.18 v1(25.52,8.66)
$1N5511: length 5.4
  Top Layer w0.203: v1(28.55,8.68) 28.77,8.46 USB1.B5 ; R6.1 v1(27.53,11.17)
  Bottom Layer w0.203: v1(28.55,8.68) 28.55,10.16 v1(27.53,11.17)
$1N5519: length 3.6
  Top Layer w0.203: 33.92,1.59 35.8,3.47 R2.2
$1N5528: length 2.9
  Top Layer w0.203: Q2.1 34.53,20.41 34.84,20.09 R14.2
$1N19675: length 3.7
  Top Layer w0.203: R16.1 13,79.62 13.4,79.23 LED2.2
$1N33225: length 7.1
  Top Layer w0.203: H19.1 8.25,81 8.25,78.51 8.66,78.1 R15.2

## Copper pours and planes (outline as drawn; the poured copper is in the pictures)
GND on Top Layer: -3.49,97.14 65.36,97.14 65.36,-3.32 -3.49,-3.32
GND on Bottom Layer: -11.66,88.23 57.2,88.23 57.2,-12.22 -11.66,-12.22

Small or netless copper shapes (teardrops, artwork), in the pictures only: 212 on Top Layer, 41 on Bottom Layer

## Text on the board
Top Silkscreen Layer: GND | 3.3V | VIN | 5V | 17 | 16 | 14 | 12 | 13 | 01 | 03 | 05 | 04 | 00 | 02 | 15 | ESP8266开发板 | G | V | S | RST | IO0
